# Altium project Q42-PMP.PrjPCB (part 1 of 4)
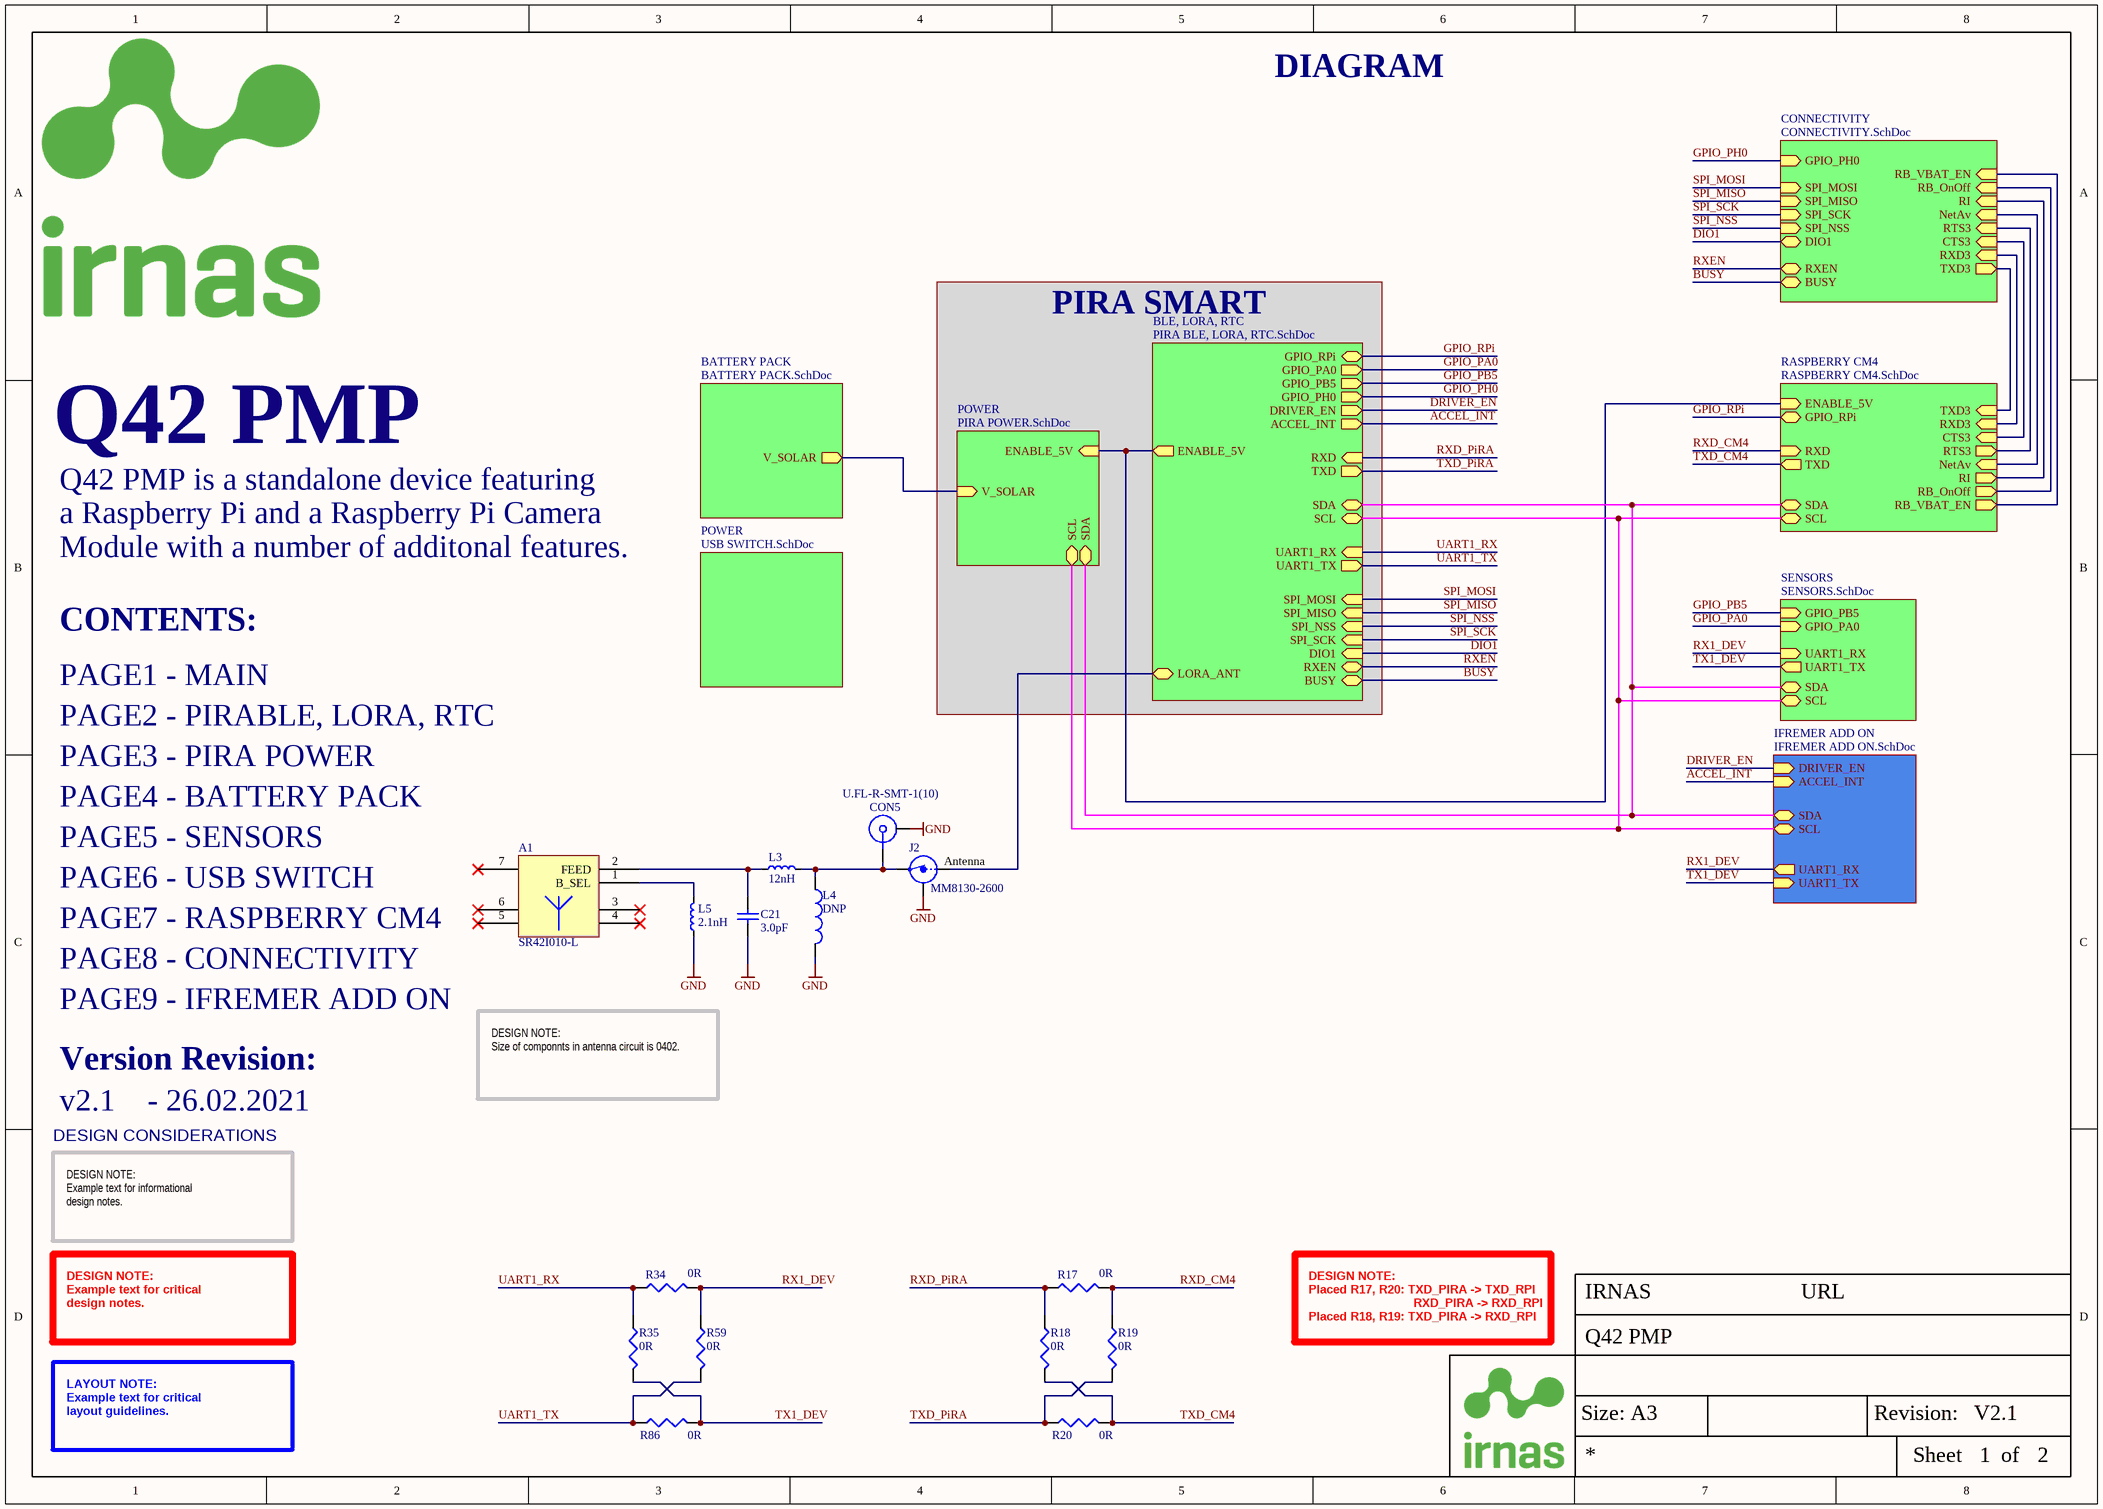
[diagram p0: MAIN.SchDoc]
Website: URL; Version: V2.1; RevisionDate: 14.11.2019; ProjectTitle: Q42 PMP; PCBDesigner: Tadej Plej; CreateDate: 13.09.2019; Company: IRNAS
9 sheets, 248 parts. Net scope: hierarchical (ports join the sheet entries above them; power ports are global).
Board file: Q42-PMP-PCB.PcbDoc
Sheets:
  MAIN.SchDoc
    BATTERY PACK = BATTERY PACK.SchDoc
    SENSORS = SENSORS.SchDoc
    POWER = PIRA POWER.SchDoc
    BLE, LORA, RTC = PIRA BLE, LORA, RTC.SchDoc
    POWER = USB SWITCH.SchDoc
    CONNECTIVITY = CONNECTIVITY.SchDoc
    IFREMER ADD ON = IFREMER ADD ON.SchDoc
    RASPBERRY CM4 = RASPBERRY CM4.SchDoc

## Sheet MAIN.SchDoc
size A3; DocumentNumber: 1; SheetNumber: 1; SheetTotal: 2

### Parts
A1  SR42I010-L  [SR42I010-L]
C21  value 3.0pF  [CAP0402]  (hidden comment: 3.0pF/50V/0402)
CON5  U.FL-R-SMT-1(10)  [ufl connector smd]
J2  MM8130-2600  [COAXIAL-SWF]
L3  value 12nH  [IND0402]  (hidden comment: 10nH/0402)
L4  DNP  [IND0402]
L5  2.1nH  [IND0402]
R17  0R  [RES0603]
R18  0R  [RES0603]
R19  0R  [RES0603]
R20  0R  [RES0603]
R34  0R  [RES0603]
R35  0R  [RES0603]
R59  0R  [RES0603]
R86  0R  [RES0603]

### Sub-sheets
BATTERY PACK = BATTERY PACK.SchDoc: V_SOLAR (out)
BLE, LORA, RTC = PIRA BLE, LORA, RTC.SchDoc: ENABLE_5V (out), SDA (bidir), UART1_RX (in), SCL (bidir), UART1_TX (out), GPIO_PH0 (out), LORA_ANT (bidir), GPIO_PB5 (out), TXD (out), RXD (in), RXEN (bidir), BUSY (bidir), GPIO_PA0 (out), DRIVER_EN (out), ACCEL_INT (out), GPIO_RPi (bidir), SPI_SCK (in), SPI_MISO (in), DIO1 (in), SPI_MOSI (in), SPI_NSS (in)
CONNECTIVITY = CONNECTIVITY.SchDoc: TXD3 (out), RXD3 (in), GPIO_PH0 (in), RB_VBAT_EN (in), RI (in), CTS3 (in), NetAv (in), RXEN (bidir), RB_OnOff (in), BUSY (bidir), DIO1 (bidir), SPI_NSS (in), SPI_MISO (in), SPI_MOSI (in), RTS3 (in), SPI_SCK (in)
IFREMER ADD ON = IFREMER ADD ON.SchDoc: DRIVER_EN (in), UART1_TX (in), SCL (bidir), SDA (bidir), ACCEL_INT (in), UART1_RX (out)
POWER = PIRA POWER.SchDoc: ENABLE_5V (in), SCL (bidir), SDA (bidir), V_SOLAR (in)
POWER = USB SWITCH.SchDoc: no entries
RASPBERRY CM4 = RASPBERRY CM4.SchDoc: CTS3 (in), RB_OnOff (out), SDA (bidir), TXD (out), RTS3 (out), ENABLE_5V (in), TXD3 (in), RB_VBAT_EN (out), NetAv (in), RI (out), GPIO_RPi (bidir), RXD (in), SCL (bidir), RXD3 (in)
SENSORS = SENSORS.SchDoc: SDA (bidir), UART1_RX (in), SCL (bidir), GPIO_PB5 (in), GPIO_PA0 (in), UART1_TX (out)

### Nets
GND: C21.1 CON5.2 J2.2(Shield) L4.1 L5.1
ACCEL_INT: sheet BLE, LORA, RTC/ACCEL_INT, sheet IFREMER ADD ON/ACCEL_INT
BUSY: sheet BLE, LORA, RTC/BUSY, sheet CONNECTIVITY/BUSY
CTS3: sheet CONNECTIVITY/CTS3, sheet RASPBERRY CM4/CTS3
DIO1: sheet BLE, LORA, RTC/DIO1, sheet CONNECTIVITY/DIO1
DRIVER_EN: sheet BLE, LORA, RTC/DRIVER_EN, sheet IFREMER ADD ON/DRIVER_EN
ENABLE_5V: sheet POWER/ENABLE_5V, sheet BLE, LORA, RTC/ENABLE_5V, sheet RASPBERRY CM4/ENABLE_5V
GPIO_PA0: sheet SENSORS/GPIO_PA0, sheet BLE, LORA, RTC/GPIO_PA0
GPIO_PB5: sheet SENSORS/GPIO_PB5, sheet BLE, LORA, RTC/GPIO_PB5
GPIO_PH0: sheet BLE, LORA, RTC/GPIO_PH0, sheet CONNECTIVITY/GPIO_PH0
GPIO_RPi: sheet BLE, LORA, RTC/GPIO_RPi, sheet RASPBERRY CM4/GPIO_RPi
LORA_ANT: J2.1(IN) ; sheet BLE, LORA, RTC/LORA_ANT
NetAv: sheet CONNECTIVITY/NetAv, sheet RASPBERRY CM4/NetAv
RB_OnOff: sheet CONNECTIVITY/RB_OnOff, sheet RASPBERRY CM4/RB_OnOff
RB_VBAT_EN: sheet CONNECTIVITY/RB_VBAT_EN, sheet RASPBERRY CM4/RB_VBAT_EN
RI: sheet CONNECTIVITY/RI, sheet RASPBERRY CM4/RI
RTS3: sheet CONNECTIVITY/RTS3, sheet RASPBERRY CM4/RTS3
RX1_DEV: R34.2 R59.1 ; sheet SENSORS/UART1_RX, sheet IFREMER ADD ON/UART1_RX  [project net GPS_TX]
RXD3: sheet CONNECTIVITY/RXD3, sheet RASPBERRY CM4/RXD3
RXD_CM4: R17.2 R19.1 ; sheet RASPBERRY CM4/RXD
RXD_PiRA: R17.1 R18.1 ; sheet BLE, LORA, RTC/RXD  [project net RXD]
RXEN: sheet BLE, LORA, RTC/RXEN, sheet CONNECTIVITY/RXEN
SCL: sheet SENSORS/SCL, sheet POWER/SCL, sheet BLE, LORA, RTC/SCL, sheet IFREMER ADD ON/SCL, sheet RASPBERRY CM4/SCL
SDA: sheet SENSORS/SDA, sheet POWER/SDA, sheet BLE, LORA, RTC/SDA, sheet IFREMER ADD ON/SDA, sheet RASPBERRY CM4/SDA
SPI_MISO: sheet BLE, LORA, RTC/SPI_MISO, sheet CONNECTIVITY/SPI_MISO
SPI_MOSI: sheet BLE, LORA, RTC/SPI_MOSI, sheet CONNECTIVITY/SPI_MOSI
SPI_NSS: sheet BLE, LORA, RTC/SPI_NSS, sheet CONNECTIVITY/SPI_NSS
SPI_SCK: sheet BLE, LORA, RTC/SPI_SCK, sheet CONNECTIVITY/SPI_SCK
TX1_DEV: R35.2 R86.2 ; sheet SENSORS/UART1_TX, sheet IFREMER ADD ON/UART1_TX  [project net GPS_RX]
TXD3: sheet CONNECTIVITY/TXD3, sheet RASPBERRY CM4/TXD3
TXD_CM4: R18.2 R20.2 ; sheet RASPBERRY CM4/TXD
TXD_PiRA: R19.2 R20.1 ; sheet BLE, LORA, RTC/TXD  [project net TXD]
UART1_RX: R34.1 R35.1 ; sheet BLE, LORA, RTC/UART1_RX
UART1_TX: R59.2 R86.1 ; sheet BLE, LORA, RTC/UART1_TX
V_SOLAR: sheet BATTERY PACK/V_SOLAR, sheet POWER/V_SOLAR
NetA1_1: A1.1(B_SEL) L5.2
NetA1_2: A1.2(FEED) C21.2 L3.1
NetCON5_1: CON5.1 J2.3(OUT) L3.2 L4.2

Not connected (* = marked no-connect by the designer): A1 3* 4* 5* 6* 7*

### Notes on the sheet
- DIAGRAM
- PIRA SMART
- Q42 PMP is a standalone device featuring
- a Raspberry Pi and a Raspberry Pi Camera
- Module with a number of additonal features.
- CONTENTS:
- PAGE1 - MAIN
- PAGE2 - PIRABLE, LORA, RTC
- PAGE3 - PIRA POWER
- PAGE4 - BATTERY PACK
- PAGE5 - SENSORS
- PAGE6 - USB SWITCH
- PAGE7 - RASPBERRY CM4
- PAGE8 - CONNECTIVITY
- PAGE9 - IFREMER ADD ON
- Version Revision:
- v2.1    - 26.02.2021
- DESIGN NOTE:
  Size of componnts in antenna circuit is 0402.
- DESIGN CONSIDERATIONS
- DESIGN NOTE:
  Example text for informational
  design notes.
- DESIGN NOTE:
  Example text for critical
  design notes.
- DESIGN NOTE:
  Placed R17, R20: TXD_PIRA -> TXD_RPI
  RXD_PIRA -> RXD_RPI
  Placed R18, R19: TXD_PIRA -> RXD_RPI
  RXD_PIRA -> TXD_RPI
- LAYOUT NOTE:
  Example text for critical
  layout guidelines.
- Size: A3
- Revision:
- Sheet
- of
- (in symbol Coaxial-Internal-SW) Antenna

### Library data of the parts
A1 = ANT - SR42I010-R_1: Antenna SMD -4dBi Gain 870MHz/928MHz Automotive 7-Pin SMD T/R; Manufacturer: Antenova; Supplier 1: Mouser; Manufacturer Part Number: SR42I010-R; Stock 1: 3154; Pricing 1: 1 = 2.36000, 10 = 1.90000, 50 = 1.90000, 100 = 1.52000, 1000 = 1.07000, 10000 = 0.95900 (USD); Supplier Part Number 1: 237-SR42I010-R
C21 = C - 3.0pF/50V/0402: CAP CER 3.0PF 50V C0G/NP0 0402; Published: 8-Jun-2000; LatestRevisionDate: 05-oct-2007  -  Semtech; LatestRevisionNote: Re-released for DXP Platform.; Publisher: Altium Limited; Supplier 1: Digi-Key; Supplier Part Number 1: 490-7756-1-ND
CON5 = U.FL-R-SMT-1(10): RF / Coaxial Connector, U.FL Coaxial, Straight Jack, Surface Mount Vertical, 50 ohm, Brass; Manufacturer: Hirose; Featured Product: U.FL Series Connectors; Connector Style: U.FL, Ultra Miniature Coaxial; Connector Type: Receptacle, Male Pin; Contact Termination: Solder; Impedance: 50 Ohm; Frequency - Max: 6GHz; Body Material: Phosphor Bronze; Body Finish: Silver; Center Contact Plating: Gold; Dielectric Material: Liquid Crystal Polymer (LCP); Online Catalog: UMCC (Ultra Miniature Coax Connectors), U.FL Series; Other Names: H11891TR  Q5400621  U.FL-R-SMT-1 10  U.FL-R-SMT-1(10)-ND  UFLRSMT110; Supplier 1: Farnell; Manufacturer Part Number: U.FL-R-SMT-1(10); Stock 1: 0; Standard Package: 2,500; Category: Connectors, Interconnects; Family: Coaxial Connectors (RF); Series: U.FL; Packaging: Tape & Reel (TR); Shield Termination: Solder; Mounting Type: Surface Mount; Cable Group: -; Fastening Type: Snap-On; Features: -; Housing Color: Beige; Ingress Protection: -; Center Contact Material: Brass; Voltage Rating: -; Operating Temperature: -40°C ~ 90°C; ComponentLink1URL: http://www.farnell.com/datasheets/91524.pdf; ComponentLink1Description: http://www.farnell.com/datasheets/91524.pdf; ComponentLink2URL: http://uk.rs-online.com/webdocs/1363/0900766b81363563.pdf; ComponentLink2Description: http://uk.rs-online.com/webdocs/1363/0900766b81363563.pdf; ComponentLink3URL: http://www.farnell.com/datasheets/1947917.pdf; ComponentLink3Description: http://www.farnell.com/datasheets/1947917.pdf; Supplier Part Number 1: 1688077
J2 = Coaxial-Internal-SW: Coaxial Connector with Switch; Manufacturer: Murata; 2nd source part number: 81-MM8130-2600RA2; Artikkelnr Noca: 55029011; Artikkelnr Simpro: N.A.; Part Number: MM8130-2600; Manufacturer Part Number: MM8130-2600; Datasheet: http://www.murata.com/products/catalog/pdf/o33e.pdf; LatestRevisionDate: 2014-04-24; Pin Count: 3; Publisher: Nordic Semiconductor; Published: 2014-04-24; Value: MM8130-2600; Note: *; Supplier: Digi-Key; Supplier part number: 490-4981-1-ND; 2nd source Supplier: Mouser; Footprint Doc: COAXIAL-SWF
L3 = L - 12nH/500mA/0402: IND 12NH 500MA 280 MOHM; Code_IEC: 1005; Published: 8-Jun-2000; LatestRevisionDate: 05-oct-2007  -  Semtech; LatestRevisionNote: Re-released for DXP Platform.; Publisher: Altium Limited; Code_JEITA: 0402; Supplier 1: Digi-Key; Supplier Part Number 1: 490-2624-1-ND
L4 = L - 4.3nH/0402: Inductor RF Chip Multi-Layer 4.3nH 0.3nH 100MHz 8Q-Factor Air 300mA 210mOhm DCR 0402 Paper T/R; Manufacturer: Murata; Manufacturer Part Number: LQG15HN4N3S02D; IRNAS Part No.: /; Q Factor: 8; Self Resonant Frequency: 6GHz; Shielding: Unshielded; DC Resistance (DCR): 210mR; Stock 1: 3502; Pricing 1: 1 = 0.10000, 10 = 0.06100, 100 = 0.04040, 500 = 0.03366, 1000 = 0.02827, 2500 = 0.02423 (USD); RoHS: Yes; Mount: Surface Mount; Case/Package: 0402; Core Material: Air; Case Code (Metric): 1005; Case Code (Imperial): 0402; Min Operating Temperature: -55°C; Max Operating Temperature: 125°C; Package Quantity: 10000; Packaging: Tape and Reel; Current Rating: 300mA; Inductance: 4.3nh; Test Frequency: 100MHz; Max DC Current: 300mA; Termination: SMD/SMT; Current: 300mA; DC Current: 300mA; Military Standard: Not; Length: 1.05mm; Height: 0.5mm; Width: 0.02inch; Height - Seated (Max): 0.022inch; Depth: 0.55mm; Radiation Hardening: No; REACH SVHC: No SVHC; Lead Free: Lead Free; ComponentLink1URL: http://uk.rs-online.com/webdocs/0f10/0900766b80f10808.pdf?src-supplier=RSComponents; ComponentLink1Description: http://uk.rs-online.com/webdocs/0f10/0900766b80f10808.pdf?src-supplier=RSComponents; ComponentLink2URL: http://search.murata.co.jp/Ceramy/image/img/PDF/ENG/L0075S0083LQG15HN.pdf?src-supplier=Avnet; ComponentLink2Description: http://search.murata.co.jp/Ceramy/image/img/PDF/ENG/L0075S0083LQG15HN.pdf?src-supplier=Avnet; ComponentLink3URL: http://www.farnell.com/datasheets/66026.pdf?src-supplier=Element14; ComponentLink3Description: http://www.farnell.com/datasheets/66026.pdf?src-supplier=Element14; ComponentLink4URL: https://www.verical.com/server-webapp/html/getDatasheet?partID=31252&src-supplier=Verical; ComponentLink4Description: https://www.verical.com/server-webapp/html/getDatasheet?partID=31252&src-supplier=Verical; ComponentLink5URL: http://search.murata.co.jp/Ceramy/image/img/PDF/ENG/L0075S0083LQG15HN.pdf?src-supplier=Avnet+Europe; ComponentLink5Description: http://search.murata.co.jp/Ceramy/image/img/PDF/ENG/L0075S0083LQG15HN.pdf?src-supplier=Avnet+Europe; ComponentLink6URL: https://search.murata.co.jp/Ceramy/image/img/P02/partnumberingAT_LQ3E.pdf?src-supplier=Digi-Key; ComponentLink6Description: https://search.murata.co.jp/Ceramy/image/img/P02/partnumberingAT_LQ3E.pdf?src-supplier=Digi-Key; Supplier 1: Farnell; Supplier Part Number 1: 1711735
L5 = L - 2.1nH/0402: Multilayer Inductor, AEC-Q200, 2.1 nH, 0.06 ohm, 8 GHz, 1 A, 0402 [1005 Metric], LQG15WH_02 Series; Supplier 1: Farnell; Supplier Part Number 1: 3263552
R17-R20 R34 R35 R59 R86 = R - 0R: BOURNS - CR0603-J/-000ELF - RES, THICK FILM, 0R, 5%, 0.1W, 0603; IRNAS Part No.: I-100011; Resistance: 0; Voltage Rating: 50; Resistor Case Style: 0603 [1608 Metric]; Power Rating: 100; Product Range: CR Series; SVHC: No SVHC (17-Dec-2015); Resistor Mounting: Surface Mount Device<!--FANDB--><div class="features-and-benefits-container"><div class="features-and-benefits-description"><span class="features-benefits-value">The Bourns CR series are standard thick film chip resistors. These resistors provide flexibility of performance, space saving and low cost. The Resistance range includes E96 and E24 decade values from 1ohm to 10Mohm.</span></div><div class="features-and-benefits-list"><ul class="features-and-benefits-list-list"><li class="features-and-benefits-list-item">0201, 0402, 0603, 0805, 1206, 1210, 2010, 2512 standard case sizes available</li><li class="features-and-benefits-list-item">±1% and ±5% tolerance</li><li class="features-and-benefits-list-item">±100ppm/°C, ±200ppm/°C and ±250ppm/°C TCR values available</li><li class="features-and-benefits-list-item">Power rating selectable for 50mW, 63mW, 0.1W, 0.125W, 0.25W, 0.5W and 1W based on ordering</li><li class="features-and-benefits-list-item">Jumpers are available for all size</li><li class="features-and-benefits-list-item">3 layer termination process with nickel barrier prevents leaching & provides excellent solderability</li><li class="features-and-benefits-list-item">Suitable for all type of soldering processes</li><li class="features-and-benefits-list-item">Tight dimensional tolerances</li><li class="features-and-benefits-list-item">Maximum working voltage depends on case size</li><li class="features-and-benefits-list-item">Operating temperature of -55°C to +125°C(CR0201) and -55°C to +155; Supplier 1: Farnell; Manufacturer: BOURNS; Manufacturer Part Number: CR0603-J/-000ELF; RoHS: YES; Stock 1: 58200; Pricing 1: 10=0.0146, 250=0.0097, 1000=0.0073, 5000=0.0049, 12500=0.0042 (GBP); Resistance Tolerance: ± 5%; Packaging: Cut Tape; Resistor Element Material: Thick Film; Temperature Coefficient: -; Automotive Qualification Standard: -; MSL: MSL 1 - Unlimited; ComponentLink1URL: http://www.bourns.com/engineering/CHPREZTR/cr0603.stp; ComponentLink1Description: http://www.bourns.com/engineering/CHPREZTR/cr0603.stp; ComponentLink2URL: http://www.farnell.com/datasheets/2178762.pdf; ComponentLink2Description: http://www.farnell.com/datasheets/2178762.pdf; Supplier Part Number 1: 2008343

## Sheet BATTERY PACK.SchDoc
size A3; DocumentNumber: 1; SheetNumber: 3; SheetTotal: 2
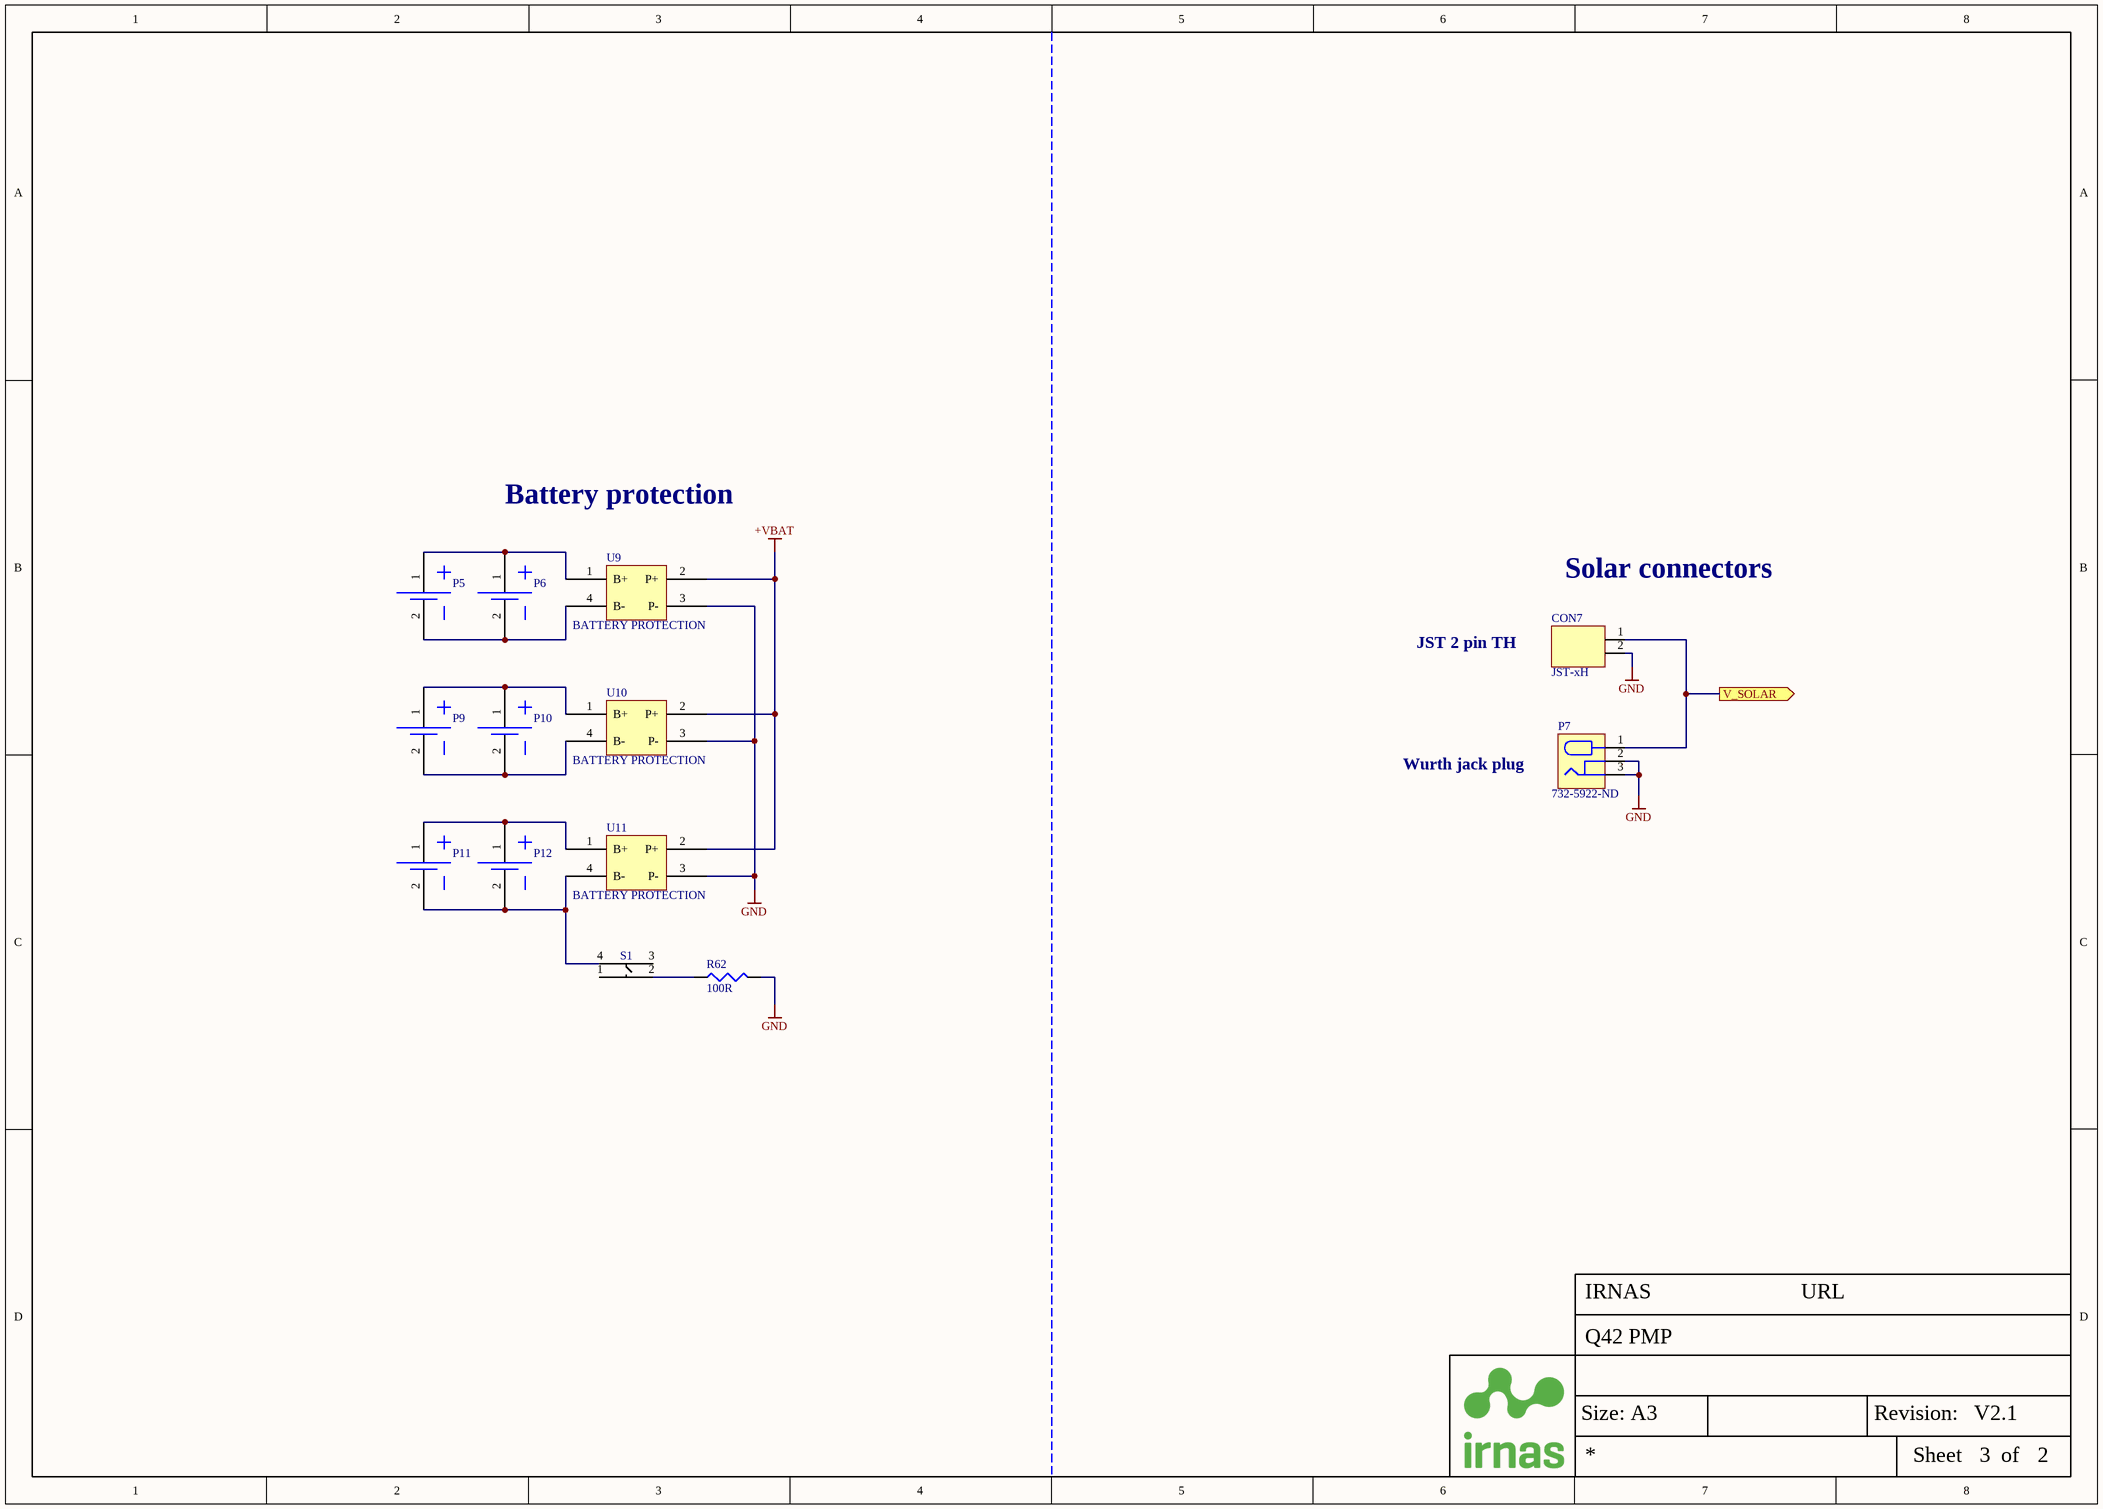
[diagram p1: BATTERY PACK.SchDoc]

### Parts
CON7  JST-xH  [JST_2PIN_TH]
P5  BAT - 18650  [BATTERY HOLDER 18650]  (value not drawn)
P6  BAT - 18650  [BATTERY HOLDER 18650]  (value not drawn)
P7  732-5922-ND  [732-5922-ND]
P9  BAT - 18650  [BATTERY HOLDER 18650]  (value not drawn)
P10  BAT - 18650  [BATTERY HOLDER 18650]  (value not drawn)
P11  BAT - 18650  [BATTERY HOLDER 18650]  (value not drawn)
P12  BAT - 18650  [BATTERY HOLDER 18650]  (value not drawn)
R62  100R  [RES0603]
S1  BTN - KMR221NGLFS  [SW]  (value not drawn)
U9  BATTERY PROTECTION  [BATTERY PROTECTION]
U10  BATTERY PROTECTION  [BATTERY PROTECTION]
U11  BATTERY PROTECTION  [BATTERY PROTECTION]

### Ports
V_SOLAR (out)

### Nets
+VBAT: U9.2(P+) U10.2(P+) U11.2(P+)
GND: CON7.2 P7.2 P7.3 R62.2 U9.3(P-) U10.3(P-) U11.3(P-)
V_SOLAR: CON7.1 P7.1 ; port V_SOLAR
NetP5_1: P5.1 P6.1 U9.1(B+)
NetP5_2: P5.2 P6.2 U9.4(B-)
NetP9_1: P9.1 P10.1 U10.1(B+)
NetP9_2: P9.2 P10.2 U10.4(B-)
NetP11_1: P11.1 P12.1 U11.1(B+)
NetP11_2: P11.2 P12.2 S1.4 U11.4(B-)
NetR62_1: R62.1 S1.2

Not connected (* = marked no-connect by the designer): S1 1 3

### Notes on the sheet
- Battery protection
- Solar connectors
- JST 2 pin TH
- Wurth jack plug
- Size: A3
- Revision:
- Sheet
- of

### Library data of the parts
CON7 = B2B-XH-A (LF)(SN): Wire-To-Board Connector, Vertical, 2.5 mm, 2 Contacts, Header, XH Series, Through Hole, 1 Rows; ComponentLink1Description: Datasheet; ComponentLink1URL: http://www.farnell.com/datasheets/2057209.pdf?_ga=2.26100990.2144023421.1568612611-1741076818.1563951383; Supplier 1: Farnell; Supplier Part Number 1: 1516276
P5 P6 P9-P12 = BAT - 18650: BATERRY HOLDER 18650; Supplier Part Number 1: Battery holder for 18650
P7 = CONN PWR JACK 1.05X3.5MM: Power Barrel Connector Jack 1.05mm ID (0.041"), 3.50mm OD (0.138") Through Hole, Right Angle; ComponentLink1Description: Datasheet; ComponentLink1URL: https://katalog.we-online.de/em/datasheet/6941xx303002.pdf; Supplier 1: Farnell; Supplier Part Number 1: 2472141
R62 = R - 100R: MULTICOMP - MC0063W06031100R - RES, THICK FILM, 100R, 1%, 0.063W, 0603; IRNAS Part No.: I-100009; Resistance: 100; Voltage Rating: 50; Resistor Case Style: 0603 [1608 Metric]; Power Rating: 63; Product Range: MC Series; Temperature Coefficient: ± 200; SVHC: No SVHC (12-Jan-2017); External Depth: 0.45; External Length / Height: 1.6; External Width: 0.8; No. of Pins: 2; Reel Quantity: 5000; Resistor Mounting: Surface Mount Device; Temperature Coeff. +: 200; Voltage Rating V DC: 50V<!--FANDB--><div class="features-and-benefits-container"><div class="features-and-benefits-description"><span class="features-benefits-value">The Multicomp MC series current sense resistors are thick film chip resistors. The resistance range includes E96 and E24 decade values from 1ohm to 10Mohm.</span></div><div class="features-and-benefits-list"><ul class="features-and-benefits-list-list"><li class="features-and-benefits-list-item">EIA 0402, 0603, 0805, 1206 chip sizes available</li><li class="features-and-benefits-list-item">Small size and low weight</li><li class="features-and-benefits-list-item">Suitable for both wave and reflow soldering</li><li class="features-and-benefits-list-item">Reduction of assembly costs</li><li class="features-and-benefits-list-item">Maximum working voltage of 50V(0402, 0603), 150V(0805), 200V(1206)</li><li class="features-and-benefits-list-item">Available in ±1%, ±2% and ±5% tolerance</li><li class="features-and-benefits-list-item">Power rating of 62.5mW, 100mW and 125mW</li><li class="features-and-benefits-list-item">±400ppm/°C(1ohm to 10ohm), ±200ppm/°C(11ohm to 100ohm), ±100; Supplier 1: Farnell; Manufacturer: MULTICOMP; Manufacturer Part Number: MC0063W06031100R; RoHS: Y-EX; Stock 1: 78152; Pricing 1: 10=0.0011, 100=0.001, 500=0.0009, 1000=0.0008, 2500=0.0007 (GBP); Resistance Tolerance: ± 1%; Packaging: Cut Tape; Resistor Element Material: Thick Film; Automotive Qualification Standard: -; Operating Temperature Max: 155; Operating Temperature Min: -55; Operating Temperature Range: -55°C to +155; Tape Width: 8; Temperature Coeff. -: 200; Tolerance +: 1%; Tolerance -: 1%; ComponentLink1URL: http://www.farnell.com/datasheets/1788326.pdf; ComponentLink1Description: http://www.farnell.com/datasheets/1788326.pdf; ComponentLink2URL: http://www.farnell.com/cad/1561149.zip; ComponentLink2Description: http://www.farnell.com/cad/1561149.zip; ComponentLink3URL: http://www.farnell.com/datasheets/2289252.pdf; ComponentLink3Description: http://www.farnell.com/datasheets/2289252.pdf; Supplier Part Number 1: 9330364
S1 = BTN - KMR221NGLFS: SWITCH TACTILE SPST-NO 0.05A 32V; Manufacturer: ITT C&K; Mechanical Life: 200000Cycles; Throw Configuration: SPST; Operating Force: 2N; Max Current Rating: 50mA; Power Rating: 1W; Illumination Type: Non-Illuminated; Switch Travel: 0.25mm; Switch Function: Off-Mom; Actuator Type: Standard; Actuator Length: 0.5mm; Supplier 1: Farnell; Manufacturer Part Number: KMR221NGLFS; Stock 1: 3038; Pricing 1: 10 = 0.29100, 500 = 0.27600, 1000 = 0.21800, 5000 = 0.18500, 10000 = 0.18100 (GBP); RoHS: Yes; Mount: Surface Mount; Case/Package: SMD/SMT; Contact Material: Silver; Contact Plating: Silver; Min Operating Temperature: -40°C; Max Operating Temperature: 85°C; Voltage Rating (DC): 32V; Packaging: Tape and Reel; Package Quantity: 1; Max Voltage Rating (DC): 32V; Current Rating: 50mA; Termination: Gull Wing; Orientation: Straight; Length: 2.8mm; Depth: 4.6mm; Radiation Hardening: No; Lead Free: Lead Free; ComponentLink1URL: https://www.ckswitches.com/media/1479/kmr2.pdf?src-supplier=Digi-Key; ComponentLink1Description: https://www.ckswitches.com/media/1479/kmr2.pdf?src-supplier=Digi-Key; ComponentLink2URL: http://www.ck-components.com/14414/kmr2_9aug12.pdf/?src-supplier=Avnet+Europe; ComponentLink2Description: http://www.ck-components.com/14414/kmr2_9aug12.pdf/?src-supplier=Avnet+Europe; ComponentLink3URL: http://www1.futureelectronics.com/doc/C%20-%20K%20COMPONENTS/KMR221NGLFS.pdf?src-supplier=Future+Electronics; ComponentLink3Description: http://www1.futureelectronics.com/doc/C%20-%20K%20COMPONENTS/KMR221NGLFS.pdf?src-supplier=Future+Electronics; Supplier Part Number 1: 2845727
U9-U11 = BATTERY PROTECTION: Supplier Part Number 1: Battery protection

## Sheet SENSORS.SchDoc
size A3; DocumentNumber: 1; SheetNumber: 4; SheetTotal: 2
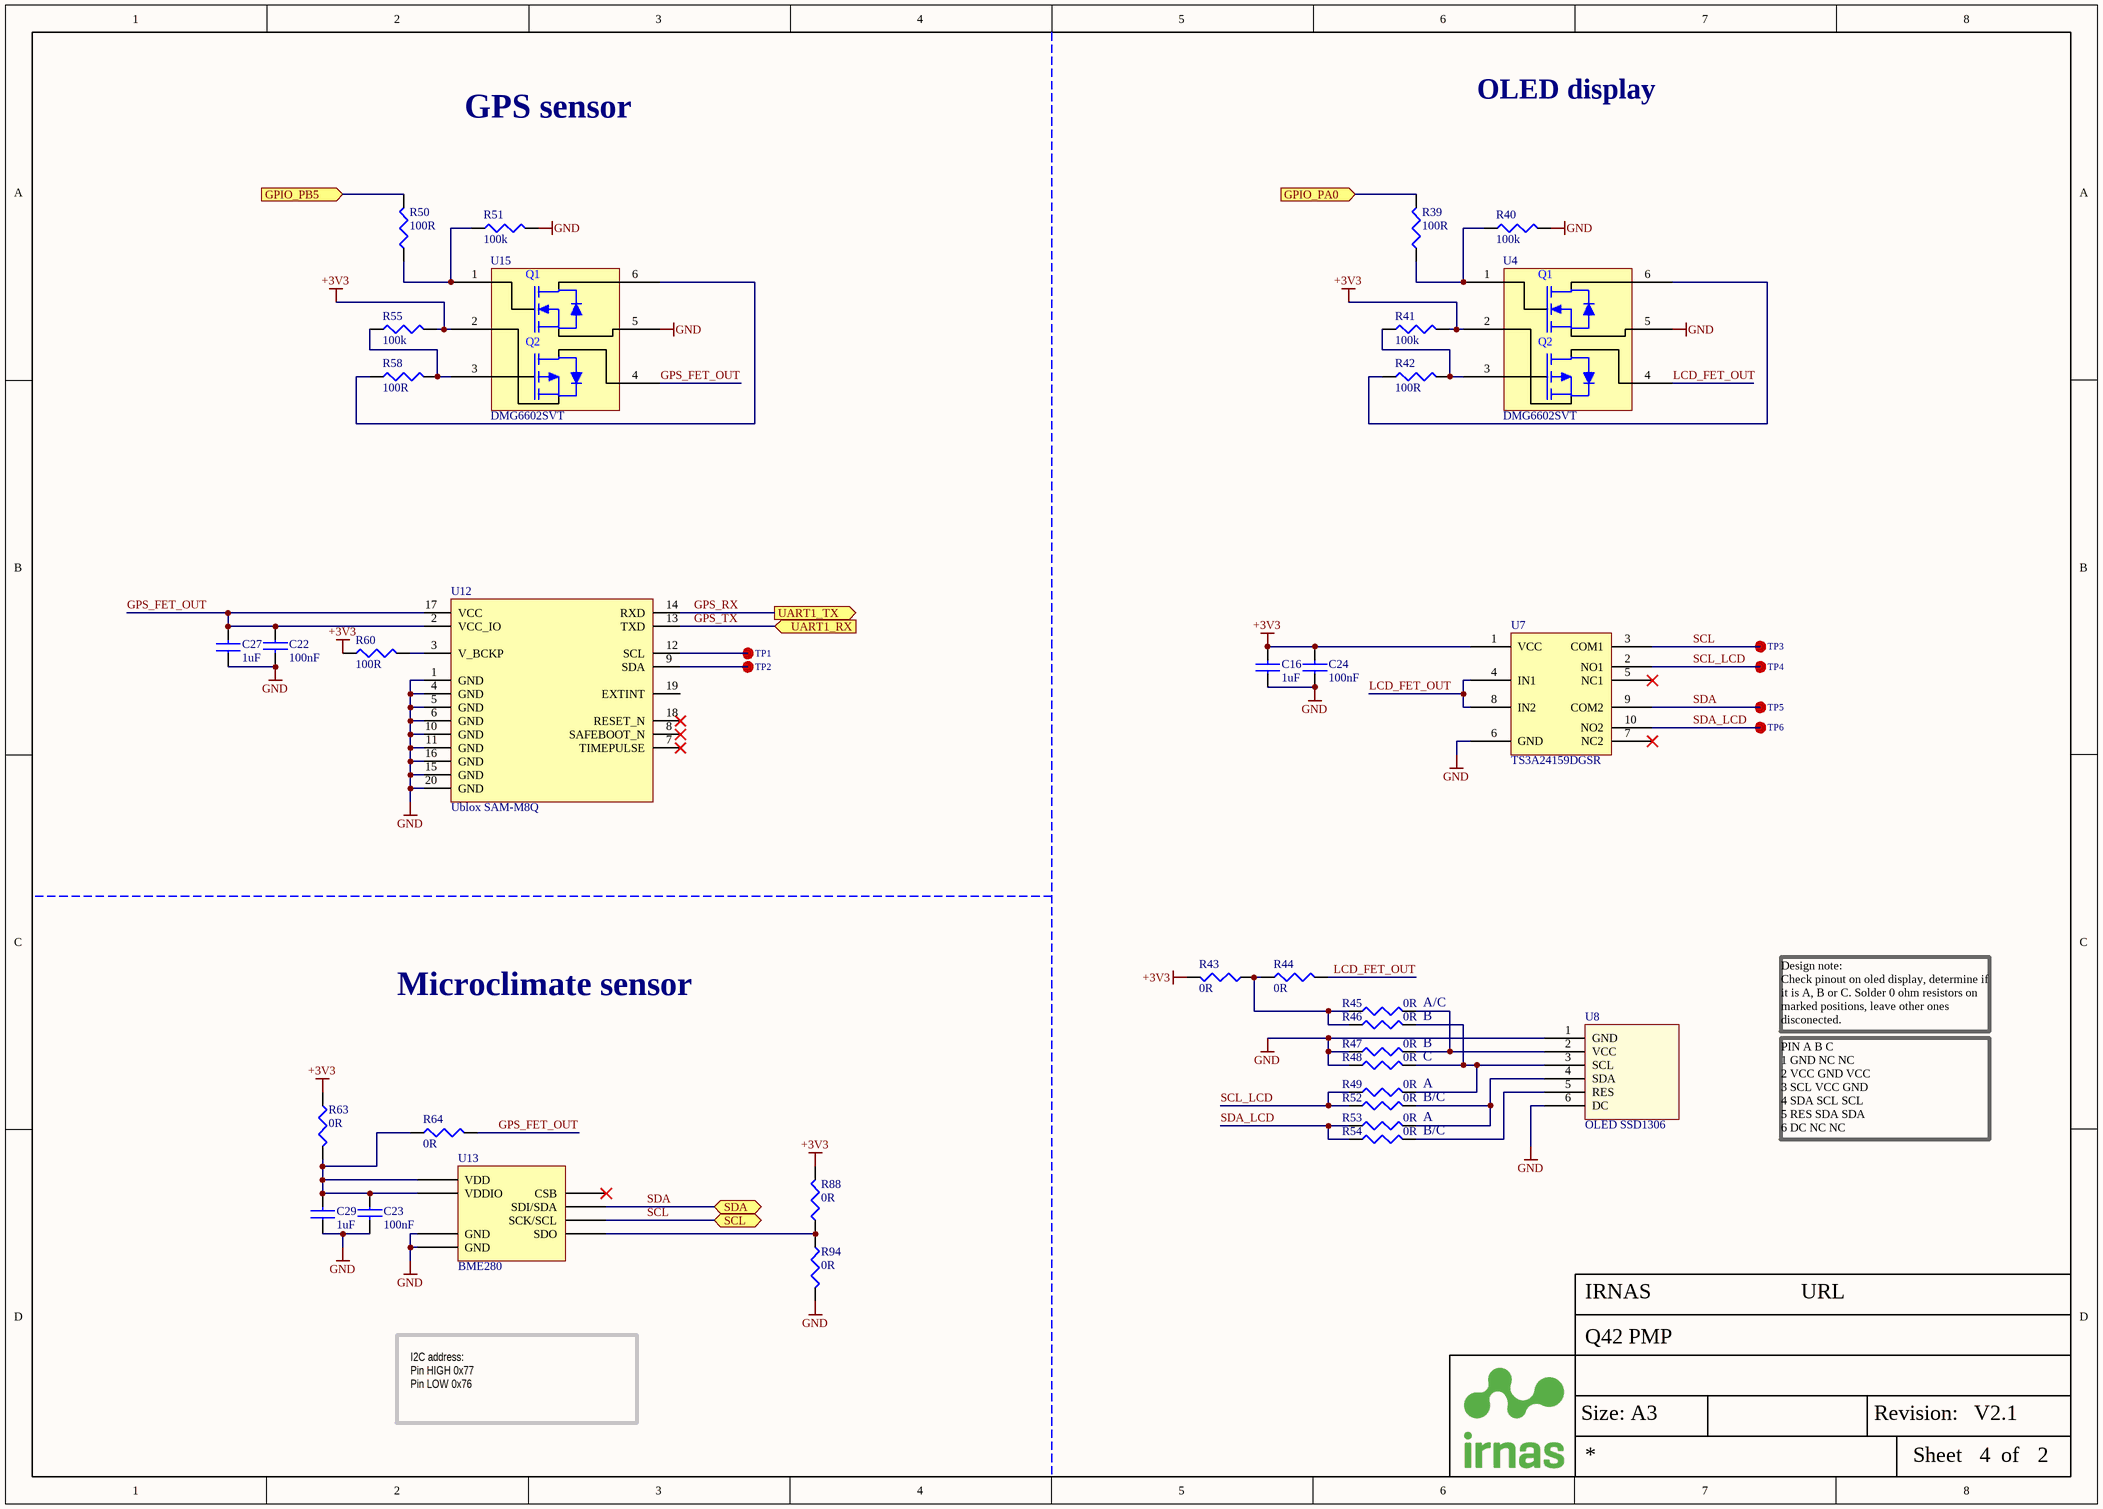
[diagram p2: SENSORS.SchDoc]

### Parts
C16  1uF  [CAP0603]
C22  100nF  [CAP0603]
C23  100nF  [CAP0603]
C24  100nF  [CAP0603]
C27  1uF  [CAP0603]
C29  1uF  [CAP0603]
R39  100R  [RES0603]
R40  100k  [RES0603]
R41  100k  [RES0603]
R42  100R  [RES0603]
R43  0R  [RES0603]
R44  0R  [RES0603]
R45  0R  [RES0603]
R46  0R  [RES0603]
R47  0R  [RES0603]
R48  0R  [RES0603]
R49  0R  [RES0603]
R50  100R  [RES0603]
R51  100k  [RES0603]
R52  0R  [RES0603]
R53  0R  [RES0603]
R54  0R  [RES0603]
R55  100k  [RES0603]
R58  100R  [RES0603]
R60  100R  [RES0603]
R63  0R  [RES0603]
R64  0R  [RES0603]
R88  0R  [RES0603]
R94  0R  [RES0603]
TP1  TestPoint  [TestPoint:1.2x1.2mm]  (value not drawn)
TP2  TestPoint  [TestPoint:1.2x1.2mm]  (value not drawn)
TP3  TestPoint  [TestPoint:1.2x1.2mm]  (value not drawn)
TP4  TestPoint  [TestPoint:1.2x1.2mm]  (value not drawn)
TP5  TestPoint  [TestPoint:1.2x1.2mm]  (value not drawn)
TP6  TestPoint  [TestPoint:1.2x1.2mm]  (value not drawn)
U4  DMG6602SVT  [TSOT26]
U7  TS3A24159DGSR  [VSSOP-10]
U8  OLED SSD1306  [OLED SSD1306]
U12  Ublox SAM-M8Q  [SAM-M8Q]
U13  BME280  [BME280]
U15  DMG6602SVT  [TSOT26]

### Ports
GPIO_PA0 (in), GPIO_PB5 (in), SCL (bidir), SDA (bidir), UART1_RX (in), UART1_TX (out)

### Nets
+3V3: C16.2 C24.2 R41.2 R43.2 R55.2 R60.1 R63.1 R88.2 U4.2(S2) U7.1(VCC) U15.2(S2)
GND: C16.1 C22.2 C23.2 C24.1 C27.1 C29.1 R40.2 R47.1 R48.1 R51.2 R94.2 U4.5(S1) U7.6(GND) U8.1(GND) U8.6(DC) U12.1(GND) U12.4(GND) U12.5(GND) U12.6(GND) U12.10(GND) U12.11(GND) U12.15(GND) U12.16(GND) U12.20(GND) U13.1(GND) U13.7(GND) U15.5(S1)
GPIO_PA0: R39.2 ; port GPIO_PA0
GPIO_PB5: R50.2 ; port GPIO_PB5
GPS_FET_OUT: C22.1 C27.2 R64.2 U12.2(VCC_IO) U12.17(VCC) U15.4(D2)
GPS_RX: U12.14(RXD) ; port UART1_TX
GPS_TX: U12.13(TXD) ; port UART1_RX
LCD_FET_OUT: R44.2 U4.4(D2) U7.4(IN1) U7.8(IN2)
SCL: TP3.0 U7.3(COM1) U13.4(SCK/SCL) ; port SCL
SCL_LCD: R49.1 R52.1 TP4.0 U7.2(NO1)
SDA: TP5.0 U7.9(COM2) U13.3(SDI/SDA) ; port SDA
SDA_LCD: R53.1 R54.1 TP6.0 U7.10(NO2)
NetC23_1: C23.1 C29.2 R63.2 R64.1 U13.6(VDDIO) U13.8(VDD)
NetR39_1: R39.1 R40.1 U4.1(G1)
NetR41_1: R41.1 R42.2 U4.3(G2)
NetR42_1: R42.1 U4.6(D1)
NetR43_1: R43.1 R44.1 R45.1 R46.1
NetR45_2: R45.2 R47.2 U8.2(VCC)
NetR46_2: R46.2 R48.2 R49.2 U8.3(SCL)
NetR50_1: R50.1 R51.1 U15.1(G1)
NetR52_2: R52.2 R53.2 U8.4(SDA)
NetR54_2: R54.2 U8.5(RES)
NetR55_1: R55.1 R58.2 U15.3(G2)
NetR58_1: R58.1 U15.6(D1)
NetR60_2: R60.2 U12.3(V_BCKP)
NetR88_1: R88.1 R94.1 U13.5(SDO)
NetTP1_0: TP1.0 U12.12(SCL)
NetTP2_0: TP2.0 U12.9(SDA)

Not connected (* = marked no-connect by the designer): U7 5(NC1)* 7(NC2)*; U12 7(TIMEPULSE)* 8(SAFEBOOT_N)* 18(RESET_N)* 19(EXTINT); U13 2(CSB)*

### Notes on the sheet
- OLED display
- GPS sensor
- Microclimate sensor
- A/C
- B
- Design note:
  Check pinout on oled display, determine if it is A, B or C. Solder 0 ohm resistors on marked positions, leave other ones disconected.
- C
- A
- B/C
- PIN	A	B	C
  1	GND	NC	NC
  2	VCC	GND	VCC
  3	SCL	VCC	GND
  4	SDA	SCL	SCL
  5	RES	SDA	SDA
  6	DC	NC	NC
- I2C address:
  Pin HIGH 0x77
  Pin LOW 0x76
- Size: A3
- Revision:
- Sheet
- of
- (in symbol T_M - DMG6602SVT) Q1; Q2

### Library data of the parts
C16 C27 C29 = C - 1uF: MURATA - GRM188R61H105KAALD - CAP, MLCC, X5R, 1UF, 50V, 0603; IRNAS Part No.: I-200006; Ceramic Capacitor Case: 0603 [1608 Metric]; Capacitance: 1; Voltage Rating: 50; Capacitance Tolerance: ± 10%; Dielectric Characteristic: X5; Product Range: GRM Series; SVHC: No SVHC (17-Dec-2015); Capacitor Terminals: SMD<!--FANDB--><div class="features-and-benefits-container"><div class="features-and-benefits-description"><span class="features-benefits-value">The Murata GRM series capacitors are Multilayer Ceramic Chip Capacitors (MLCC) used for general purpose applications. These MLCC capacitors are classified into temperature compensating and high dielectric constant types depending on the change in electrostatic capacitance due to change in temperature. The temperature compensating capacitors feature a small rate of change in electrostatic capacitance as the temperature changes and are used for applications such as filters and high frequency circuit matching. The high dielectric constant capacitors use materials with a high dielectric constant and feature a large electrostatic capacitance. Typical applications are power supply decoupling and smoothing circuits.</span></div><div class="features-and-benefits-list"><ul class="features-and-benefits-list-list"><li class="features-and-benefits-list-item">Large capacity and small size in a multilayer structure</li><li class="features-and-benefits-list-item">Capacitance value ranging from 0.1pF to 220?F</li><li class="features-and-benefits-list-item">Tin plated external electrodes, excellent solderability</li><li class="features-and-benefits-list-item">Provides good high frequency characteristics</li><li class="features-and-benefits-list-item">Excellent pulse response</li><li class="features-and-benefits-list-item">High reliability</li><li class="features-and-benefits-list-item">Capacitor size varies from 0.4×0.2mm to 5.7×5.0mm</li><li class="features-and-benefits-list-item">Rated voltage of 2.5VDC to 3.15; Supplier 1: Farnell; Manufacturer: MURATA; Manufacturer Part Number: GRM188R61H105KAALD; RoHS: YES; Stock 1: 62682; Pricing 1: 10=0.093, 100=0.062, 500=0.0507, 1000=0.0465, 2000=0.0429, 4000=0.0399, 20000=0.0372, 40000=0.0365 (GBP); Packaging: Cut Tape; Operating Temperature Min: -55; Operating Temperature Max: 85; Automotive Qualification Standard: -; MSL: -; Capacitance Tolerance ±: ± 10%; ComponentLink1URL: http://www.farnell.com/datasheets/2048611.pdf; ComponentLink1Description: http://www.farnell.com/datasheets/2048611.pdf; Supplier Part Number 1: 1845736
C22-C24 = C - 100nF: MURATA - GRM188R71C104KA01J - CAP, MLCC, X7R, 0.1UF, 16V, 0603; IRNAS Part No.: I-200005; Ceramic Capacitor Case: 0603 [1608 Metric]; Capacitance: 0.1; Voltage Rating: 16; Capacitance Tolerance: ± 10%; Dielectric Characteristic: X7; Product Range: GRM Series; SVHC: No SVHC (20-Jun-2016; Supplier 1: Farnell; Manufacturer: MURATA; Manufacturer Part Number: GRM188R71C104KA01J; RoHS: YES; Stock 1: 18297; Pricing 1: 10=0.0145, 100=0.0126, 500=0.0081, 2500=0.0059, 5000=0.0052, 10000=0.0046, 50000=0.0036, 100000=0.0035 (GBP); Packaging: Cut Tape; Operating Temperature Min: -55; Operating Temperature Max: 125; Automotive Qualification Standard: -; MSL: MSL 1 - Unlimited; ComponentLink1URL: http://www.farnell.com/datasheets/2189124.pdf; ComponentLink1Description: http://www.farnell.com/datasheets/2189124.pdf; Supplier Part Number 1: 2688519
R39 R42 R50 R58 R60 = R - 100R: as R62 on sheet BATTERY PACK; Supplier 1: Farnell; Manufacturer: MULTICOMP; Manufacturer Part Number: MC0063W06031100R; RoHS: Y-EX; Stock 1: 78152; Pricing 1: 10=0.0011, 100=0.001, 500=0.0009, 1000=0.0008, 2500=0.0007 (GBP); Resistance Tolerance: ± 1%; Packaging: Cut Tape; Resistor Element Material: Thick Film; Automotive Qualification Standard: -; Operating Temperature Max: 155; Operating Temperature Min: -55; Operating Temperature Range: -55°C to +155; Tape Width: 8; Temperature Coeff. -: 200; Tolerance +: 1%; Tolerance -: 1%; ComponentLink1URL: http://www.farnell.com/datasheets/1788326.pdf; ComponentLink1Description: http://www.farnell.com/datasheets/1788326.pdf; ComponentLink2URL: http://www.farnell.com/cad/1561149.zip; ComponentLink2Description: http://www.farnell.com/cad/1561149.zip; ComponentLink3URL: http://www.farnell.com/datasheets/2289252.pdf; ComponentLink3Description: http://www.farnell.com/datasheets/2289252.pdf; Supplier Part Number 1: 9330364
R40 R41 R51 R55 = R - 100k: MULTICOMP - MCMR06X104 JTL - RES, CERAMIC, 100K, 5%, 0.1W, 0603; IRNAS Part No.: I-100007; Resistance: 100; Voltage Rating: 75; Resistor Case Style: 0603 [1608 Metric]; Product Range: MCMR Series; Temperature Coefficient: ± 100; Resistor Mounting: Surface Mount Device<!--FANDB--><div class="features-and-benefits-container"><div class="features-and-benefits-description"><span class="features-benefits-value">The Multicomp MCMR series resistors are automotive grade, anti sulphured thick film chip resistor. The resistance range includes E24 and E96 decade values from 1ohm to 10Mohm. These resistors are constructed on top of a high grade ceramic body.</span></div><div class="features-and-benefits-list"><ul class="features-and-benefits-list-list"><li class="features-and-benefits-list-item">EIA 0402, 0603, 0805, 1206 chip sizes available</li><li class="features-and-benefits-list-item">High reliability and stability</li><li class="features-and-benefits-list-item">Automotive grade AEC-Q200 compliant</li><li class="features-and-benefits-list-item">Complaint with (IEC 60068-1) 55/155/56 climatic category</li><li class="features-and-benefits-list-item">Maximum operation voltage of 50V, 75V, 150V and 200V</li><li class="features-and-benefits-list-item">Power rating of 62.5mW, 100mW, 125mW and 250mW</li><li class="features-and-benefits-list-item">Available in ±1% and ±5% tolerance</li><li class="features-and-benefits-list-item">Temperature coefficient (TCR) of +200ppm/°C, +100ppm/°C and -200ppm/°C to +400ppm/°C</li><li class="features-and-benefits-list-item">Operating temperature range -55°C to 155; Supplier 1: Farnell; Manufacturer: MULTICOMP; Manufacturer Part Number: MCMR06X104 JTL; RoHS: Y-EX; Stock 1: 187; Pricing 1: 10=0.0109, 100=0.0085, 500=0.006, 1000=0.0048, 2500=0.004, 5000=0.003, 25000=0.002, 50000=0.0016 (GBP); Power Rating: 100; Resistance Tolerance: ± 5%; Packaging: Cut Tape; Resistor Element Material: Ceramic; Automotive Qualification Standard: -; ComponentLink1URL: http://www.farnell.com/datasheets/1716707.pdf; ComponentLink1Description: http://www.farnell.com/datasheets/1716707.pdf; Supplier Part Number 1: 2073357
R43-R49 R52-R54 R63 R64 R88 R94 = R - 0R: as R17 on sheet MAIN; Supplier 1: Farnell; Manufacturer: BOURNS; Manufacturer Part Number: CR0603-J/-000ELF; RoHS: YES; Stock 1: 58200; Pricing 1: 10=0.0146, 250=0.0097, 1000=0.0073, 5000=0.0049, 12500=0.0042 (GBP); Resistance Tolerance: ± 5%; Packaging: Cut Tape; Resistor Element Material: Thick Film; Temperature Coefficient: -; Automotive Qualification Standard: -; MSL: MSL 1 - Unlimited; ComponentLink1URL: http://www.bourns.com/engineering/CHPREZTR/cr0603.stp; ComponentLink1Description: http://www.bourns.com/engineering/CHPREZTR/cr0603.stp; ComponentLink2URL: http://www.farnell.com/datasheets/2178762.pdf; ComponentLink2Description: http://www.farnell.com/datasheets/2178762.pdf; Supplier Part Number 1: 2008343
TP1-TP6 = TestPoint: TEST POINT ROUND SMD; FIT: 0.94; Komp / Device: SMD; ComponentLink1Description: Datasheet
U4 U15 = T_M - DMG6602SVT: Dual MOSFET, N and P Channel, 3.4 A, 30 V, 0.038 ohm, 10 V, 1 V; ComponentLink1Description: Datasheet; ComponentLink1URL: http://www.farnell.com/datasheets/1915929.pdf?_ga=2.95290844.1984085946.1565589483-1741076818.1563951383; Supplier 1: Farnell; Supplier Part Number 1: 2061522
U7 = INT - TS3A24159DGSR: Analogue Switch, 2 Channels, SPDT, 0.34 ohm, 1.65V to 3.6V, VSSOP, 10 Pins; Supplier 1: Farnell; Supplier Part Number 1: 3118263; ComponentLink1Description: Datasheet; ComponentLink1URL: https://www.ti.com/lit/ds/symlink/ts3a24159.pdf?HQS=TI-null-null-mousermode-df-pf-null-wwe&ts=1604495897645&ref_url=https%253A%252F%252Fwww.mouser.de%252F
U12 = RF - UBLOX-SAM-M8Q: SAM-M8 RF Receiver BeiDou, Galileo, GLONASS, GNSS, GPS -160dBm; Manufacturer: u-blox; Manufacturer Part Number: MAX-M8Q-0; Stock 1: 10805; Supplier 1: Digi-Key; Supplier Part Number 1: 672-1054-1-ND
U13 = SEN - BME280: Humidity Temperature Sensor 0 ~ 100% RH I²C, SPI ±3% 1s Surface Mount; ComponentLink1Description: Datasheet; ComponentLink1URL: https://ae-bst.resource.bosch.com/media/_tech/media/datasheets/BST-BME280-DS002.pdf; Supplier 1: Digi-Key; Supplier Part Number 1: 828-1063-6-ND
U8 = OLED SSD1306: Supplier Part Number 1: OLED SSD 1306 display